# EAGLE board dotflipper (EAGLE 9.1.1), part 1 of 2
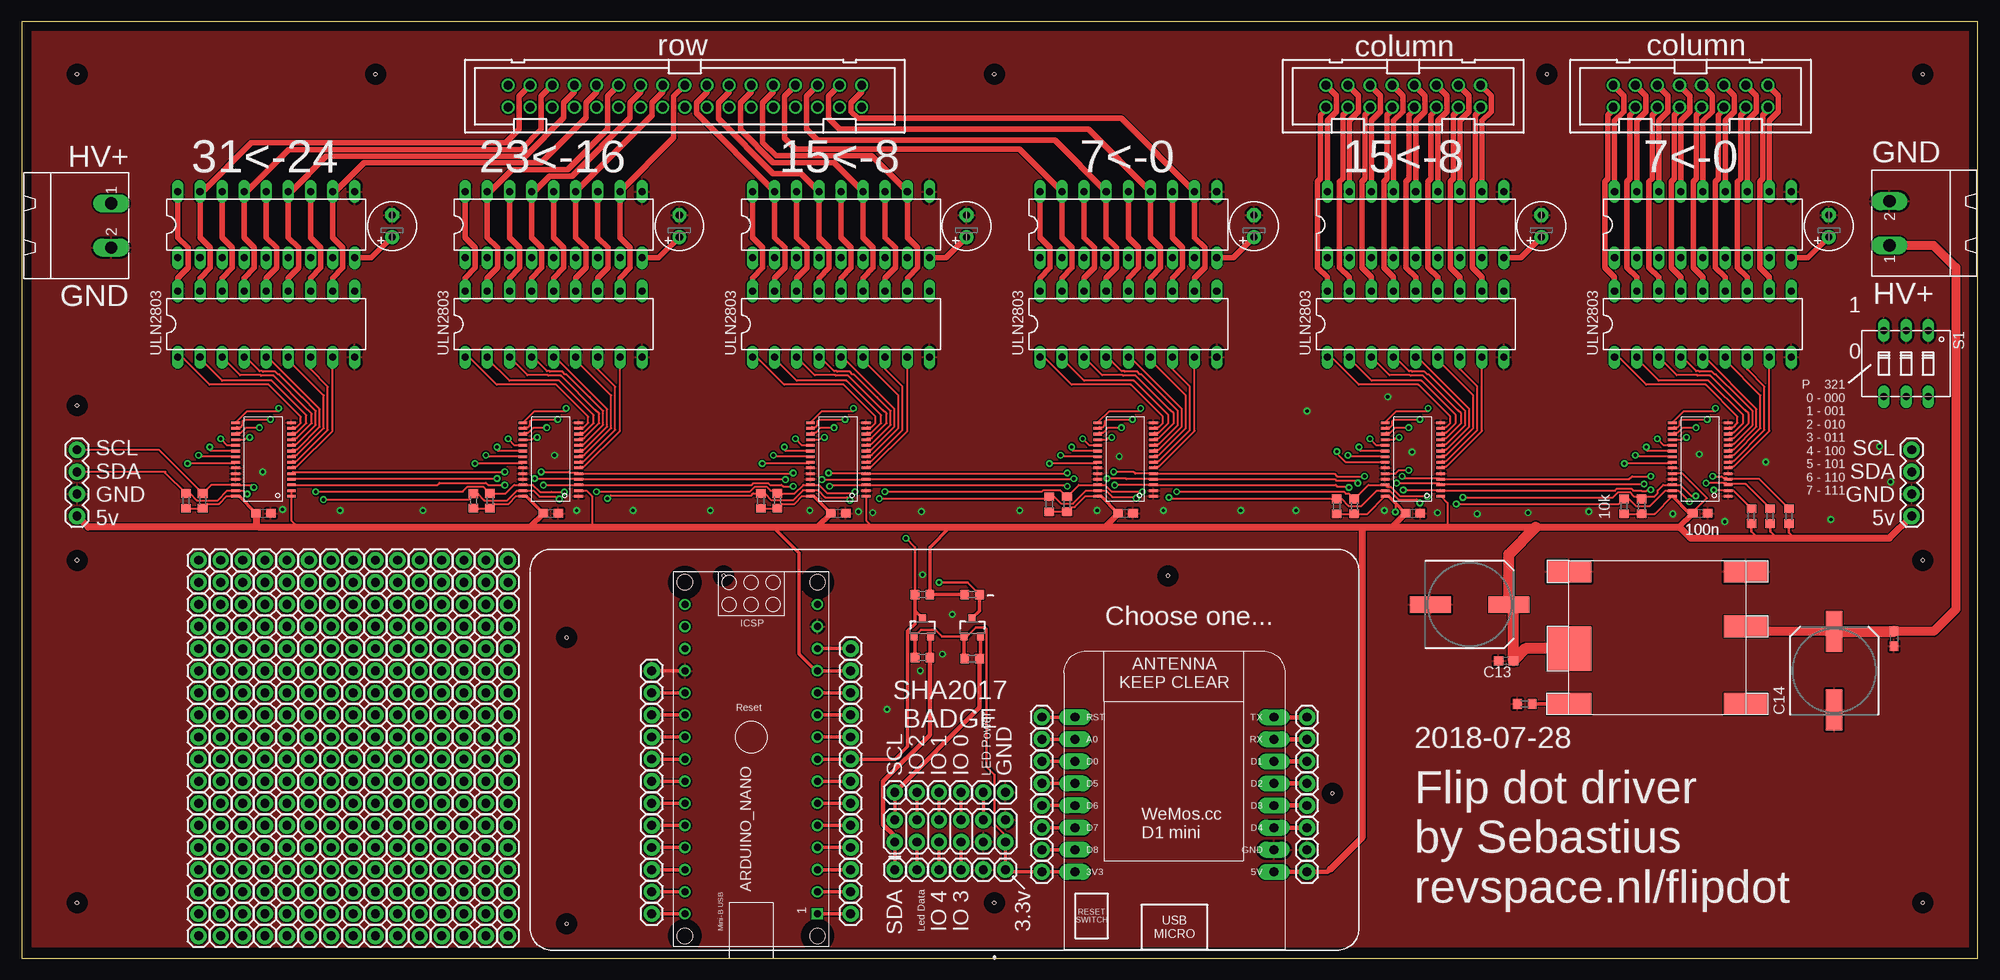
[diagram p3: board, top side]
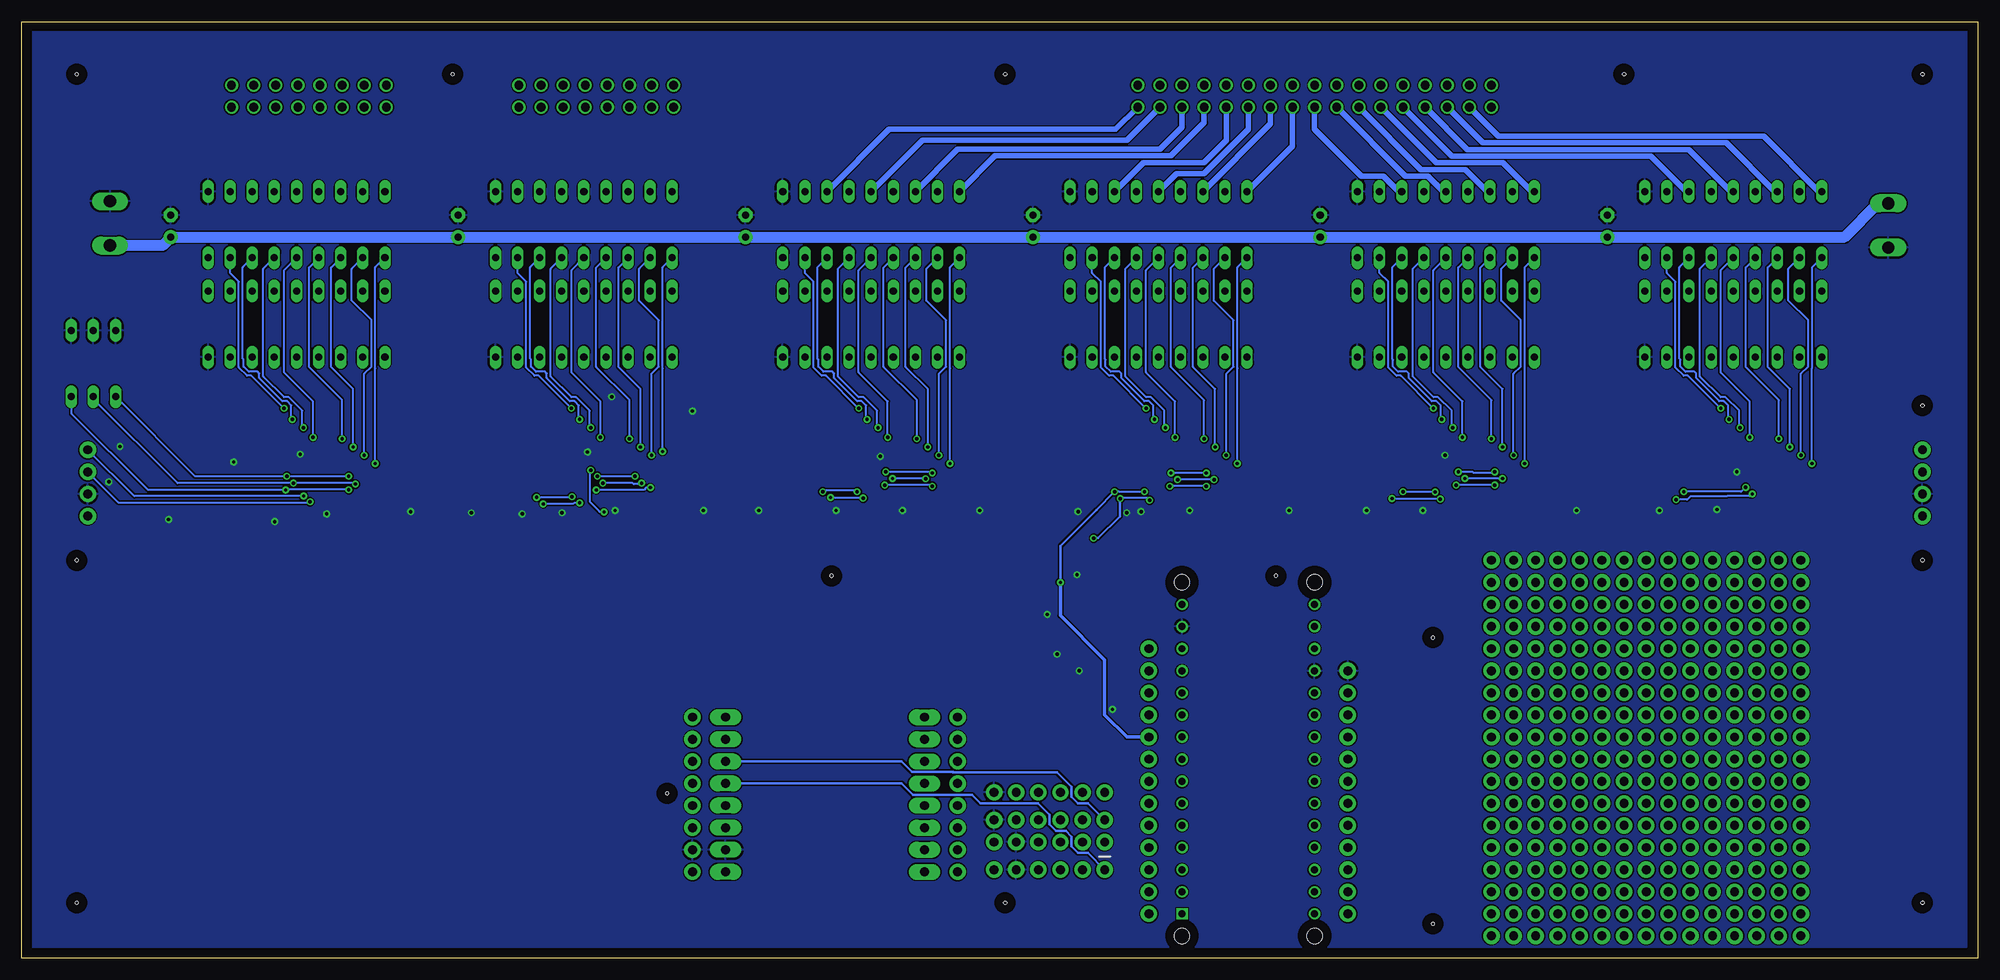
[diagram p4: board, bottom side, seen from below]

Size 224.77 x 107.62 mm. Coordinates in mm from the lower left corner, seen from the top.
Outline: 0,0 224.77,0 224.77,107.62 0,107.62 0,0
Copper layers (1*16): Top 0.035mm / dielectric 1.5mm / Bottom 0.035mm
Design rules "default": minimum track width 6mil, minimum drill 0.35mm, track to track 6mil, track to pad 6mil, pad to pad 6mil, via to via 6mil, smd to smd 6mil, copper to edge 40mil, drill to drill 6mil, minimum pad ring 10mil, minimum via ring 8mil, stop-mask expansion 4mil, vias tented up to drill 0mil, thermal gap 10mil
Holes 0.38 mm at 80.64,43.94 62.61,36.83 62.61,3.94 150.62,18.92 131.7,43.94 6.35,101.6 6.35,6.35 218.44,6.35 218.44,101.6 111.76,101.6 111.76,6.35 175.26,101.6 40.64,101.6 6.35,45.72 6.35,63.5 218.44,45.72

## Footprints (pad centres in the part's own frame; a part is rotated, then mirrored left to right if it is on the bottom)
ARDUINO_NANO = drill 0.8 square: 1 -20.32,-7.62 | drill 0.8: 2 -17.78,-7.62; 3 -15.24,-7.62; 4 -12.7,-7.62; 5 -10.16,-7.62; 6 -7.62,-7.62; 7 -5.08,-7.62; 8 -2.54,-7.62; 9 0,-7.62; 10 2.54,-7.62; 11 5.08,-7.62; 12 7.62,-7.62; 13 10.16,-7.62; 14 12.7,-7.62; 15 15.24,-7.62; 16 15.24,7.62; 17 12.7,7.62; 18 10.16,7.62; 19 7.62,7.62; 20 5.08,7.62; 21 2.54,7.62; 22 0,7.62; 23 -2.54,7.62; 24 -5.08,7.62; 25 -7.62,7.62; 26 -10.16,7.62; 27 -12.7,7.62; 28 -15.24,7.62; 29 -17.78,7.62; 30 -20.32,7.62 | hole 1.778: -22.86,-7.62; -22.86,7.62; 17.78,7.62; 17.78,-7.62
C0603 = smd 1.1 x 1: 1 -0.85,0; 2 0.85,0
SANYO-OSCON_SMD_F8 = smd 4.7 x 1.9: + 4.5,0; - -4.5,0
E2,5-6 = drill 0.813 pad 1.6: + -1.27,0 | drill 0.813 pad 1.6 octagon: - 1.27,0
DIL18 = drill 0.813 long: 1 -10.16,-3.81; 2 -7.62,-3.81; 3 -5.08,-3.81; 4 -2.54,-3.81; 5 0,-3.81; 6 2.54,-3.81; 7 5.08,-3.81; 8 7.62,-3.81; 9 10.16,-3.81; 10 10.16,3.81; 11 7.62,3.81; 12 5.08,3.81; 13 2.54,3.81; 14 0,3.81; 15 -2.54,3.81; 16 -5.08,3.81; 17 -7.62,3.81; 18 -10.16,3.81
TSSOP-28_4MM = smd 1 x 0.3: 1 -3.2,4.225; 2 -3.2,3.575; 3 -3.2,2.925; 4 -3.2,2.275; 5 -3.2,1.625; 6 -3.2,0.975; 7 -3.2,0.325; 8 -3.2,-0.325; 9 -3.2,-0.975; 10 -3.2,-1.625; 11 -3.2,-2.275; 12 -3.2,-2.925; 13 -3.2,-3.575; 14 -3.2,-4.225; 15 3.2,-4.225; 16 3.2,-3.575; 17 3.2,-2.925; 18 3.2,-2.275; 19 3.2,-1.625; 20 3.2,-0.975; 21 3.2,-0.325; 22 3.2,0.325; 23 3.2,0.975; 24 3.2,1.625; 25 3.2,2.275; 26 3.2,2.925; 27 3.2,3.575; 28 3.2,4.225
1X04 = drill 1.016 pad 1.88: 1 0,0; 2 2.54,0; 3 5.08,0; 4 7.62,0
2X6 = drill 1.016 pad 1.88: 1 0,0; 2 0,2.54; 3 2.54,0; 4 2.54,2.54; 5 5.08,0; 6 5.08,2.54; 7 7.62,0; 8 7.62,2.54; 9 10.16,0; 10 10.16,2.54; 11 12.7,0; 12 12.7,2.54
1X01 = drill 1.016 pad 1.88: 1 0,0
SOT23-3 = smd 0.8 x 0.9: 1 -0.95,-1; 2 0.95,-1; 3 0,1.1
R0603 = smd 1 x 1.1: 1 -0.85,0; 2 0.85,0
DIP03YL = drill 0.813 long: 1 -2.54,-3.81; 2 0,-3.81; 3 2.54,-3.81; 4 2.54,3.81; 5 0,3.81; 6 -2.54,3.81
KIS-3R33S = smd 5.08 x 2.54: 1 10.16,-7.62; 2 10.16,1.27; 3 10.16,7.62; 4 -10.16,7.62; 6 -10.16,-7.62 | smd 5.08 x 5.08: 5 -10.16,-1.27
WEMOS-D1-MINI = drill 1.016 pad 1.829 long: 3V3 -10.16,-10.16; 5V 12.7,-10.16; A0 -10.16,5.08; D0 -10.16,2.54; D1 12.7,2.54; D2 12.7,0; D3 12.7,-2.54; D4 12.7,-5.08; D5 -10.16,0; D6 -10.16,-2.54; D7 -10.16,-5.08; D8 -10.16,-7.62; GND 12.7,-7.62; RESET -10.16,7.62; RX 12.7,5.08; TX 12.7,7.62
PAK100/2500-34 = drill 1 pad 1.422: 1 -20.32,-1.27; 2 -20.32,1.27; 3 -17.78,-1.27; 4 -17.78,1.27; 5 -15.24,-1.27; 6 -15.24,1.27; 7 -12.7,-1.27; 8 -12.7,1.27; 9 -10.16,-1.27; 10 -10.16,1.27; 11 -7.62,-1.27; 12 -7.62,1.27; 13 -5.08,-1.27; 14 -5.08,1.27; 15 -2.54,-1.27; 16 -2.54,1.27; 17 0,-1.27; 18 0,1.27; 19 2.54,-1.27; 20 2.54,1.27; 21 5.08,-1.27; 22 5.08,1.27; 23 7.62,-1.27; 24 7.62,1.27; 25 10.16,-1.27; 26 10.16,1.27; 27 12.7,-1.27; 28 12.7,1.27; 29 15.24,-1.27; 30 15.24,1.27; 31 17.78,-1.27; 32 17.78,1.27; 33 20.32,-1.27; 34 20.32,1.27
PAK100/2500-16 = drill 1 pad 1.422: 1 -8.89,-1.27; 2 -8.89,1.27; 3 -6.35,-1.27; 4 -6.35,1.27; 5 -3.81,-1.27; 6 -3.81,1.27; 7 -1.27,-1.27; 8 -1.27,1.27; 9 1.27,-1.27; 10 1.27,1.27; 11 3.81,-1.27; 12 3.81,1.27; 13 6.35,-1.27; 14 6.35,1.27; 15 8.89,-1.27; 16 8.89,1.27
MSTBA2 = drill 1.397 long: 1 -2.54,5.08; 2 2.54,5.08

## Placement (x,y rotation side)
ARDUINO_NANO  [ARDUINO_NANO]  83.82,25.4 90 top
C1  100n  [C0603]  215.14,36.7 270 top
C2  [SANYO-OSCON_SMD_F8]  166.37,40.64 0 top
C3  100n  [C0603]  126.84,51.12 0 top
C4  [E2,5-6]  141.6,84.14 90 top
C5  100n  [C0603]  159.86,51.12 0 top
C6  [E2,5-6]  174.62,84.14 90 top
C7  100n  [C0603]  93.82,51.12 0 top
C8  [E2,5-6]  108.58,84.14 90 top
C9  100n  [C0603]  192.88,51.12 0 top
C10  [E2,5-6]  207.65,84.14 90 top
C11  100n  [C0603]  60.8,51.12 0 top
C12  [E2,5-6]  75.56,84.14 90 top
C13  100n  [C0603]  170.56,34.16 180 top
C14  [SANYO-OSCON_SMD_F8]  208.28,33.02 90 top
C15  100n  [C0603]  27.78,51.12 0 top
C16  [E2,5-6]  42.55,84.14 90 top
IC4  UDN2982  [DIL18]  127.16,84.3 0 top
IC5  [DIL18]  127.16,72.87 0 top
IC6  PCA9685  [TSSOP-28_4MM]  126.84,57.31 180 top
IC7  UDN2982  [DIL18]  160.18,84.3 0 top
IC8  [DIL18]  160.18,72.87 0 top
IC9  PCA9685  [TSSOP-28_4MM]  159.86,57.31 180 top
IC10  UDN2982  [DIL18]  94.14,84.3 0 top
IC11  [DIL18]  94.14,72.87 0 top
IC12  PCA9685  [TSSOP-28_4MM]  93.82,57.31 180 top
IC13  UDN2982  [DIL18]  193.2,84.3 0 top
IC14  [DIL18]  193.2,72.87 0 top
IC15  PCA9685  [TSSOP-28_4MM]  192.88,57.31 180 top
IC16  UDN2982  [DIL18]  61.12,84.3 0 top
IC17  [DIL18]  61.12,72.87 0 top
IC18  PCA9685  [TSSOP-28_4MM]  60.8,57.31 180 top
IC22  UDN2982  [DIL18]  28.1,84.3 0 top
IC23  [DIL18]  28.1,72.87 0 top
IC24  PCA9685  [TSSOP-28_4MM]  27.78,57.31 180 top
J1  [1X04]  217.17,58.42 270 top
J2  [1X04]  6.35,58.42 270 top
J3  SHA BADGE  [2X6]  100.33,13.34 0 top
J4  [1X01]  100.33,19.05 0 top
J5  [1X01]  102.87,19.05 0 top
J6  [1X01]  105.41,19.05 0 top
J7  [1X01]  107.95,19.05 0 top
J8  [1X01]  110.49,19.05 0 top
J9  [1X01]  147.7,12.45 0 top
J10  [1X01]  113.03,10.16 0 top
J11  [1X01]  110.49,10.16 0 top
J12  [1X01]  107.95,10.16 0 top
J13  [1X01]  105.41,10.16 0 top
J14  [1X01]  102.87,10.16 0 top
J15  [1X01]  100.33,10.16 0 top
J16  [1X01]  117.22,27.69 0 top
J17  [1X01]  117.22,25.15 0 top
J18  [1X01]  117.22,22.61 0 top
J19  [1X01]  117.22,20.07 0 top
J20  [1X01]  117.22,17.53 0 top
J21  [1X01]  117.22,14.99 0 top
J22  [1X01]  117.22,12.45 0 top
J23  [1X01]  117.22,9.91 0 top
J24  [1X01]  147.7,27.69 0 top
J25  [1X01]  147.7,25.15 0 top
J26  [1X01]  147.7,22.61 0 top
J27  [1X01]  147.7,20.07 0 top
J28  [1X01]  147.7,17.53 0 top
J29  [1X01]  147.7,14.99 0 top
J30  [1X01]  113.03,19.05 0 top
J31  [1X01]  147.7,9.91 0 top
J32  [1X01]  55.88,45.72 0 top
J33  [1X01]  50.8,45.72 0 top
J34  [1X01]  45.72,45.72 0 top
J35  [1X01]  40.64,45.72 0 top
J36  [1X01]  35.56,45.72 0 top
J37  [1X01]  30.48,45.72 0 top
J38  [1X01]  25.4,45.72 0 top
J39  [1X01]  20.32,45.72 0 top
J40  [1X01]  55.88,43.18 0 top
J41  [1X01]  50.8,43.18 0 top
J42  [1X01]  45.72,43.18 0 top
J43  [1X01]  40.64,43.18 0 top
J44  [1X01]  35.56,43.18 0 top
J45  [1X01]  30.48,43.18 0 top
J46  [1X01]  25.4,43.18 0 top
J47  [1X01]  20.32,43.18 0 top
J48  [1X01]  22.86,43.18 0 top
J49  [1X01]  53.34,45.72 0 top
J50  [1X01]  48.26,45.72 0 top
J51  [1X01]  43.18,45.72 0 top
J52  [1X01]  38.1,45.72 0 top
J53  [1X01]  33.02,45.72 0 top
J54  [1X01]  27.94,45.72 0 top
J55  [1X01]  22.86,45.72 0 top
J56  [1X01]  72.39,33.02 90 top
J57  [1X01]  53.34,43.18 0 top
J58  [1X01]  48.26,43.18 0 top
J59  [1X01]  43.18,43.18 0 top
J60  [1X01]  38.1,43.18 0 top
J61  [1X01]  33.02,43.18 0 top
J62  [1X01]  27.94,43.18 0 top
J63  [1X01]  72.39,30.48 90 top
J64  [1X01]  72.39,27.94 90 top
J65  [1X01]  72.39,25.4 90 top
J66  [1X01]  72.39,22.86 90 top
J67  [1X01]  72.39,20.32 90 top
J68  [1X01]  72.39,17.78 90 top
J69  [1X01]  72.39,15.24 90 top
J70  [1X01]  72.39,12.7 90 top
J71  [1X01]  72.39,10.16 90 top
J72  [1X01]  72.39,7.62 90 top
J73  [1X01]  72.39,5.08 90 top
J74  [1X01]  95.25,5.08 270 top
J75  [1X01]  95.25,7.62 270 top
J76  [1X01]  95.25,10.16 270 top
J77  [1X01]  95.25,12.7 270 top
J78  [1X01]  95.25,15.24 270 top
J79  [1X01]  95.25,17.78 270 top
J80  [1X01]  95.25,20.32 270 top
J81  [1X01]  95.25,22.86 270 top
J82  [1X01]  95.25,25.4 270 top
J83  [1X01]  95.25,27.94 270 top
J84  [1X01]  95.25,30.48 270 top
J85  [1X01]  95.25,33.02 270 top
J86  [1X01]  95.25,35.56 270 top
J92  [1X01]  20.32,38.1 180 top
J93  [1X01]  25.4,38.1 180 top
J94  [1X01]  30.48,38.1 180 top
J95  [1X01]  35.56,38.1 180 top
J96  [1X01]  40.64,38.1 180 top
J97  [1X01]  45.72,38.1 180 top
J98  [1X01]  50.8,38.1 180 top
J99  [1X01]  55.88,38.1 180 top
J100  [1X01]  20.32,40.64 180 top
J101  [1X01]  25.4,40.64 180 top
J102  [1X01]  30.48,40.64 180 top
J103  [1X01]  35.56,40.64 180 top
J104  [1X01]  40.64,40.64 180 top
J105  [1X01]  45.72,40.64 180 top
J106  [1X01]  50.8,40.64 180 top
J107  [1X01]  55.88,40.64 180 top
J108  [1X01]  53.34,40.64 180 top
J109  [1X01]  22.86,38.1 180 top
J110  [1X01]  27.94,38.1 180 top
J111  [1X01]  33.02,38.1 180 top
J112  [1X01]  38.1,38.1 180 top
J113  [1X01]  43.18,38.1 180 top
J114  [1X01]  48.26,38.1 180 top
J115  [1X01]  53.34,38.1 180 top
J116  [1X01]  22.86,40.64 180 top
J117  [1X01]  27.94,40.64 180 top
J118  [1X01]  33.02,40.64 180 top
J119  [1X01]  38.1,40.64 180 top
J120  [1X01]  43.18,40.64 180 top
J121  [1X01]  48.26,40.64 180 top
J152  [1X01]  55.88,35.56 0 top
J153  [1X01]  50.8,35.56 0 top
J154  [1X01]  45.72,35.56 0 top
J155  [1X01]  40.64,35.56 0 top
J156  [1X01]  35.56,35.56 0 top
J157  [1X01]  30.48,35.56 0 top
J158  [1X01]  25.4,35.56 0 top
J159  [1X01]  20.32,35.56 0 top
J160  [1X01]  55.88,33.02 0 top
J161  [1X01]  50.8,33.02 0 top
J162  [1X01]  45.72,33.02 0 top
J163  [1X01]  40.64,33.02 0 top
J164  [1X01]  35.56,33.02 0 top
J165  [1X01]  30.48,33.02 0 top
J166  [1X01]  25.4,33.02 0 top
J167  [1X01]  20.32,33.02 0 top
J168  [1X01]  22.86,33.02 0 top
J169  [1X01]  53.34,35.56 0 top
J170  [1X01]  48.26,35.56 0 top
J171  [1X01]  43.18,35.56 0 top
J172  [1X01]  38.1,35.56 0 top
J173  [1X01]  33.02,35.56 0 top
J174  [1X01]  27.94,35.56 0 top
J175  [1X01]  22.86,35.56 0 top
J176  [1X01]  53.34,33.02 0 top
J177  [1X01]  48.26,33.02 0 top
J178  [1X01]  43.18,33.02 0 top
J179  [1X01]  38.1,33.02 0 top
J180  [1X01]  33.02,33.02 0 top
J181  [1X01]  27.94,33.02 0 top
J212  [1X01]  55.88,15.24 0 top
J213  [1X01]  50.8,15.24 0 top
J214  [1X01]  45.72,15.24 0 top
J215  [1X01]  40.64,15.24 0 top
J216  [1X01]  35.56,15.24 0 top
J217  [1X01]  30.48,15.24 0 top
J218  [1X01]  25.4,15.24 0 top
J219  [1X01]  20.32,15.24 0 top
J220  [1X01]  55.88,12.7 0 top
J221  [1X01]  50.8,12.7 0 top
J222  [1X01]  45.72,12.7 0 top
J223  [1X01]  40.64,12.7 0 top
J224  [1X01]  35.56,12.7 0 top
J225  [1X01]  30.48,12.7 0 top
J226  [1X01]  25.4,12.7 0 top
J227  [1X01]  20.32,12.7 0 top
J228  [1X01]  22.86,12.7 0 top
J229  [1X01]  53.34,15.24 0 top
J230  [1X01]  48.26,15.24 0 top
J231  [1X01]  43.18,15.24 0 top
J232  [1X01]  38.1,15.24 0 top
J233  [1X01]  33.02,15.24 0 top
J234  [1X01]  27.94,15.24 0 top
J235  [1X01]  22.86,15.24 0 top
J236  [1X01]  53.34,12.7 0 top
J237  [1X01]  48.26,12.7 0 top
J238  [1X01]  43.18,12.7 0 top
J239  [1X01]  38.1,12.7 0 top
J240  [1X01]  33.02,12.7 0 top
J241  [1X01]  27.94,12.7 0 top
J242  [1X01]  20.32,7.62 180 top
J243  [1X01]  25.4,7.62 180 top
J244  [1X01]  30.48,7.62 180 top
J245  [1X01]  35.56,7.62 180 top
J246  [1X01]  40.64,7.62 180 top
J247  [1X01]  45.72,7.62 180 top
J248  [1X01]  50.8,7.62 180 top
J249  [1X01]  55.88,7.62 180 top
J250  [1X01]  20.32,10.16 180 top
J251  [1X01]  25.4,10.16 180 top
J252  [1X01]  30.48,10.16 180 top
J253  [1X01]  35.56,10.16 180 top
J254  [1X01]  40.64,10.16 180 top
J255  [1X01]  45.72,10.16 180 top
J256  [1X01]  50.8,10.16 180 top
J257  [1X01]  55.88,10.16 180 top
J258  [1X01]  53.34,10.16 180 top
J259  [1X01]  22.86,7.62 180 top
J260  [1X01]  27.94,7.62 180 top
J261  [1X01]  33.02,7.62 180 top
J262  [1X01]  38.1,7.62 180 top
J263  [1X01]  43.18,7.62 180 top
J264  [1X01]  48.26,7.62 180 top
J265  [1X01]  53.34,7.62 180 top
J266  [1X01]  22.86,10.16 180 top
J267  [1X01]  27.94,10.16 180 top
J268  [1X01]  33.02,10.16 180 top
J269  [1X01]  38.1,10.16 180 top
J270  [1X01]  43.18,10.16 180 top
J271  [1X01]  48.26,10.16 180 top
J272  [1X01]  55.88,5.08 0 top
J273  [1X01]  50.8,5.08 0 top
J274  [1X01]  45.72,5.08 0 top
J275  [1X01]  40.64,5.08 0 top
J276  [1X01]  35.56,5.08 0 top
J277  [1X01]  30.48,5.08 0 top
J278  [1X01]  25.4,5.08 0 top
J279  [1X01]  20.32,5.08 0 top
J280  [1X01]  55.88,2.54 0 top
J281  [1X01]  50.8,2.54 0 top
J282  [1X01]  45.72,2.54 0 top
J283  [1X01]  40.64,2.54 0 top
J284  [1X01]  35.56,2.54 0 top
J285  [1X01]  30.48,2.54 0 top
J286  [1X01]  25.4,2.54 0 top
J287  [1X01]  20.32,2.54 0 top
J288  [1X01]  22.86,2.54 0 top
J289  [1X01]  53.34,5.08 0 top
J290  [1X01]  48.26,5.08 0 top
J291  [1X01]  43.18,5.08 0 top
J292  [1X01]  38.1,5.08 0 top
J293  [1X01]  33.02,5.08 0 top
J294  [1X01]  27.94,5.08 0 top
J295  [1X01]  22.86,5.08 0 top
J296  [1X01]  53.34,2.54 0 top
J297  [1X01]  48.26,2.54 0 top
J298  [1X01]  43.18,2.54 0 top
J299  [1X01]  38.1,2.54 0 top
J300  [1X01]  33.02,2.54 0 top
J301  [1X01]  27.94,2.54 0 top
J302  [1X01]  20.32,17.78 180 top
J303  [1X01]  25.4,17.78 180 top
J304  [1X01]  30.48,17.78 180 top
J305  [1X01]  35.56,17.78 180 top
J306  [1X01]  40.64,17.78 180 top
J307  [1X01]  45.72,17.78 180 top
J308  [1X01]  50.8,17.78 180 top
J309  [1X01]  55.88,17.78 180 top
J310  [1X01]  20.32,20.32 180 top
J311  [1X01]  25.4,20.32 180 top
J312  [1X01]  30.48,20.32 180 top
J313  [1X01]  35.56,20.32 180 top
J314  [1X01]  40.64,20.32 180 top
J315  [1X01]  45.72,20.32 180 top
J316  [1X01]  50.8,20.32 180 top
J317  [1X01]  55.88,20.32 180 top
J318  [1X01]  53.34,20.32 180 top
J319  [1X01]  22.86,17.78 180 top
J320  [1X01]  27.94,17.78 180 top
J321  [1X01]  33.02,17.78 180 top
J322  [1X01]  38.1,17.78 180 top
J323  [1X01]  43.18,17.78 180 top
J324  [1X01]  48.26,17.78 180 top
J325  [1X01]  53.34,17.78 180 top
J326  [1X01]  22.86,20.32 180 top
J327  [1X01]  27.94,20.32 180 top
J328  [1X01]  33.02,20.32 180 top
J329  [1X01]  38.1,20.32 180 top
J330  [1X01]  43.18,20.32 180 top
J331  [1X01]  48.26,20.32 180 top
J332  [1X01]  55.88,25.4 0 top
J333  [1X01]  50.8,25.4 0 top
J334  [1X01]  45.72,25.4 0 top
J335  [1X01]  40.64,25.4 0 top
J336  [1X01]  35.56,25.4 0 top
J337  [1X01]  30.48,25.4 0 top
J338  [1X01]  25.4,25.4 0 top
J339  [1X01]  20.32,25.4 0 top
J340  [1X01]  55.88,22.86 0 top
J341  [1X01]  50.8,22.86 0 top
J342  [1X01]  45.72,22.86 0 top
J343  [1X01]  40.64,22.86 0 top
J344  [1X01]  35.56,22.86 0 top
J345  [1X01]  30.48,22.86 0 top
J346  [1X01]  25.4,22.86 0 top
J347  [1X01]  20.32,22.86 0 top
J348  [1X01]  22.86,22.86 0 top
J349  [1X01]  53.34,25.4 0 top
J350  [1X01]  48.26,25.4 0 top
J351  [1X01]  43.18,25.4 0 top
J352  [1X01]  38.1,25.4 0 top
J353  [1X01]  33.02,25.4 0 top
J354  [1X01]  27.94,25.4 0 top
J355  [1X01]  22.86,25.4 0 top
J356  [1X01]  53.34,22.86 0 top
J357  [1X01]  48.26,22.86 0 top
J358  [1X01]  43.18,22.86 0 top
J359  [1X01]  38.1,22.86 0 top
J360  [1X01]  33.02,22.86 0 top
J361  [1X01]  27.94,22.86 0 top
J362  [1X01]  20.32,27.94 180 top
J363  [1X01]  25.4,27.94 180 top
J364  [1X01]  30.48,27.94 180 top
J365  [1X01]  35.56,27.94 180 top
J366  [1X01]  40.64,27.94 180 top
J367  [1X01]  45.72,27.94 180 top
J368  [1X01]  50.8,27.94 180 top
J369  [1X01]  55.88,27.94 180 top
J370  [1X01]  20.32,30.48 180 top
J371  [1X01]  25.4,30.48 180 top
J372  [1X01]  30.48,30.48 180 top
J373  [1X01]  35.56,30.48 180 top
J374  [1X01]  40.64,30.48 180 top
J375  [1X01]  45.72,30.48 180 top
J376  [1X01]  50.8,30.48 180 top
J377  [1X01]  55.88,30.48 180 top
J378  [1X01]  53.34,30.48 180 top
J379  [1X01]  22.86,27.94 180 top
J380  [1X01]  27.94,27.94 180 top
J381  [1X01]  33.02,27.94 180 top
J382  [1X01]  38.1,27.94 180 top
J383  [1X01]  43.18,27.94 180 top
J384  [1X01]  48.26,27.94 180 top
J385  [1X01]  53.34,27.94 180 top
J386  [1X01]  22.86,30.48 180 top
J387  [1X01]  27.94,30.48 180 top
J388  [1X01]  33.02,30.48 180 top
J389  [1X01]  38.1,30.48 180 top
J390  [1X01]  43.18,30.48 180 top
J391  [1X01]  48.26,30.48 180 top
Q1  BSS138  [SOT23-3]  109.22,37.97 0 top
Q2  BSS138  [SOT23-3]  103.5,37.97 0 top
R1  10k  [R0603]  118.08,52.17 270 top
R2  10k  [R0603]  120.11,52.17 270 top
R3  10k  [R0603]  151.1,51.91 270 top
R4  10k  [R0603]  153.13,51.91 270 top
R5  10k  [R0603]  198.75,50.8 270 top
R6  10k  [R0603]  200.91,50.8 270 top
R7  10k  [R0603]  84.93,52.55 270 top
R8  10k  [R0603]  86.84,52.55 270 top
R9  10k  [R0603]  184.12,51.91 270 top
R10  10k  [R0603]  186.15,51.91 270 top
R11  10k  [R0603]  51.91,52.55 270 top
R12  10k  [R0603]  53.82,52.55 270 top
R13  10k  [R0603]  203.07,50.8 270 top
R14  10k  [R0603]  109.22,34.42 180 top
R15  10k  [R0603]  18.89,52.55 270 top
R16  10k  [R0603]  20.8,52.55 270 top
R17  10k  [R0603]  109.22,41.78 180 top
R18  10k  [R0603]  103.5,34.54 180 top
R19  10k  [R0603]  103.5,41.78 0 top
R20  10k  [R0603]  172.72,29.21 180 top
S1  [DIP03YL]  216.53,68.33 180 top
U$1  KIS-3R33S  [KIS-3R33S]  187.96,36.83 0 top
WEMOS1  Wemos D1 mini  [WEMOS-D1-MINI]  131.19,20.07 0 top
X1  2534-  [PAK100/2500-34]  76.2,99.06 180 top
X2  2516-  [PAK100/2500-16]  158.75,99.06 180 top
X3  2516-  [PAK100/2500-16]  191.77,99.06 180 top
X4  MSTBA2  [MSTBA2]  5.21,84.2 270 top
X5  MSTBA2  [MSTBA2]  219.71,84.45 90 top